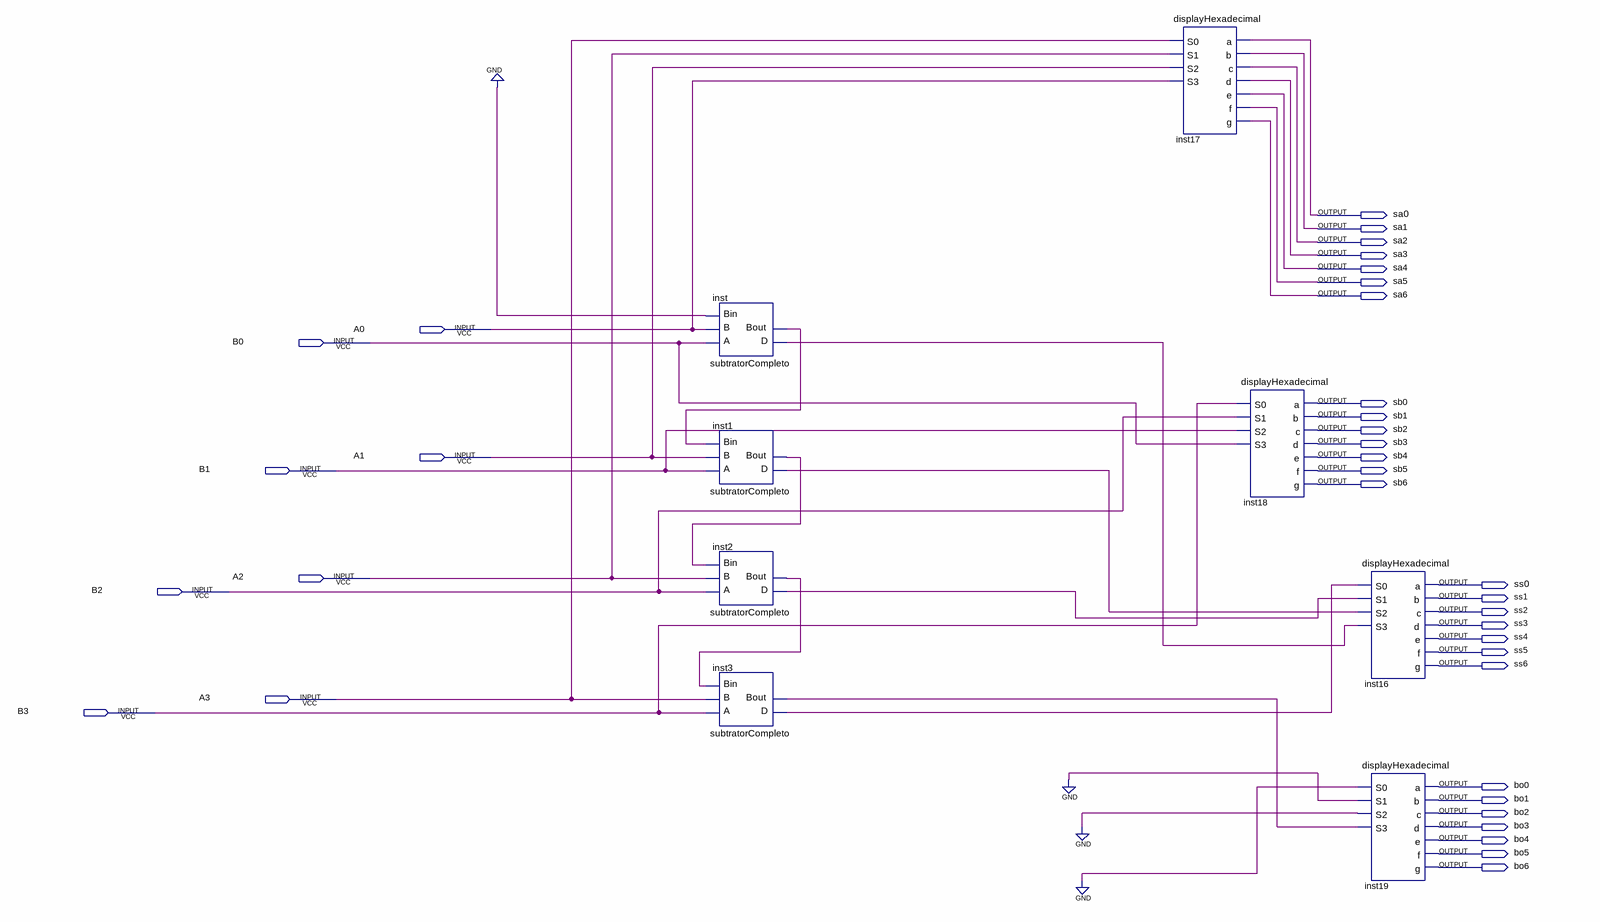
[diagram p0: schematic sheet]
// Quartus schematic aula08.bdf as structural Verilog: 8 symbols, 36 pins
module aula08 (
  input  A0,
  input  B0,
  input  A1,
  input  B1,
  input  A2,
  input  B2,
  input  A3,
  input  B3,
  output sa0,
  output sa1,
  output sa2,
  output sa3,
  output sa4,
  output sa5,
  output sa6,
  output sb0,
  output sb1,
  output sb2,
  output sb3,
  output sb4,
  output sb5,
  output sb6,
  output ss0,
  output ss1,
  output ss2,
  output ss3,
  output ss4,
  output ss5,
  output ss6,
  output bo0,
  output bo1,
  output bo2,
  output bo3,
  output bo4,
  output bo5,
  output bo6
);

  wire inst1_bout, inst1_d, inst2_bout, inst2_d, inst3_bout, inst3_d, inst_bout, inst_d;

  subtratorCompleto inst (.A(B0), .B(A0), .Bin(1'b0), .D(inst_d), .Bout(inst_bout));
  subtratorCompleto inst1 (.A(B1), .B(A1), .Bin(inst_bout), .D(inst1_d), .Bout(inst1_bout));
  subtratorCompleto inst2 (.A(B2), .B(A2), .Bin(inst1_bout), .D(inst2_d), .Bout(inst2_bout));
  subtratorCompleto inst3 (.A(B3), .B(A3), .Bin(inst2_bout), .D(inst3_d), .Bout(inst3_bout));
  displayHexadecimal inst17 (
    .S0(A3), .S1(A2), .S2(A1), .S3(A0), .a(sa0), .b(sa1), .c(sa2), .d(sa3), .e(sa4), .f(sa5), .g(sa6));
  displayHexadecimal inst18 (
    .S0(B3), .S1(B2), .S2(B1), .S3(B0), .a(sb0), .b(sb1), .c(sb2), .d(sb3), .e(sb4), .f(sb5), .g(sb6));
  displayHexadecimal inst16 (
    .S0(inst3_d), .S1(inst2_d), .S2(inst1_d), .S3(inst_d), .a(ss0), .b(ss1), .c(ss2), .d(ss3), .e(ss4),
    .f(ss5), .g(ss6));
  displayHexadecimal inst19 (
    .S0(1'b0), .S1(1'b0), .S2(1'b0), .S3(inst3_bout), .a(bo0), .b(bo1), .c(bo2), .d(bo3), .e(bo4), .f(bo5),
    .g(bo6));
endmodule
